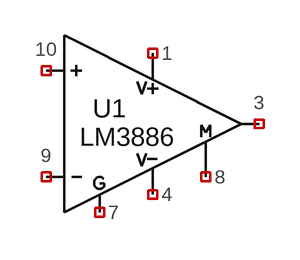
[diagram p0: schematic lm3886.asc]
lm3886.asc, the LTspice schematic file:
Version 4
SHEET 1 880 680
SYMBOL LM3886 144 80 R0
SYMATTR InstName U1

The netlist it stands for:
* lm3886.asc
XU1 NC_01 NC_02 NC_03 NC_04 NC_05 NC_06 NC_07 LM3886  ; pins 10 9 1 4 7 3 8
.lib LM3886.lib
.backanno
.end